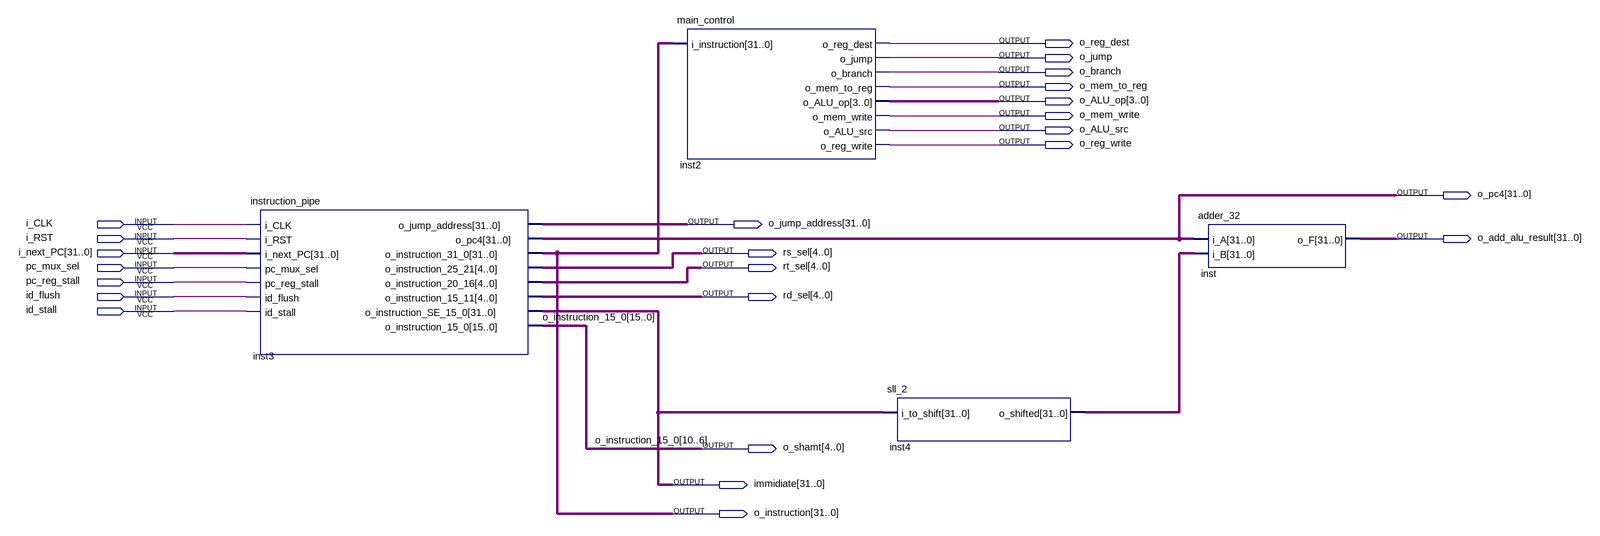
[diagram p0: schematic sheet]
// Quartus schematic instruction_control_pipe.bdf as structural Verilog: 4 symbols, 24 pins
module instruction_control_pipe (
  input  i_CLK,
  input  i_RST,
  input  [31:0] i_next_PC,
  input  pc_mux_sel,
  input  pc_reg_stall,
  input  id_flush,
  input  id_stall,
  output o_reg_dest,
  output o_jump,
  output o_branch,
  output o_mem_to_reg,
  output [3:0] o_ALU_op,
  output o_mem_write,
  output o_ALU_src,
  output o_reg_write,
  output [31:0] o_pc4,
  output [31:0] o_jump_address,
  output [31:0] o_add_alu_result,
  output [4:0] rs_sel,
  output [4:0] rt_sel,
  output [4:0] rd_sel,
  output [4:0] o_shamt,
  output [31:0] immidiate,
  output [31:0] o_instruction
);

  wire [15:0] o_instruction_15_0;
  wire [31:0] inst4_o_shifted;

  instruction_pipe inst3 (
    .i_CLK(i_CLK), .i_RST(i_RST), .i_next_PC(i_next_PC), .pc_mux_sel(pc_mux_sel),
    .pc_reg_stall(pc_reg_stall), .id_flush(id_flush), .id_stall(id_stall), .o_jump_address(o_jump_address),
    .o_pc4(o_pc4), .o_instruction_31_0(o_instruction), .o_instruction_25_21(rs_sel),
    .o_instruction_20_16(rt_sel), .o_instruction_15_11(rd_sel), .o_instruction_SE_15_0(immidiate),
    .o_instruction_15_0({o_instruction_15_0[15:11], o_shamt, o_instruction_15_0[5:0]}));
  main_control inst2 (
    .i_instruction(o_instruction), .o_reg_dest(o_reg_dest), .o_jump(o_jump), .o_branch(o_branch),
    .o_mem_to_reg(o_mem_to_reg), .o_ALU_op(o_ALU_op), .o_mem_write(o_mem_write), .o_ALU_src(o_ALU_src),
    .o_reg_write(o_reg_write));
  sll_2 inst4 (.i_to_shift(immidiate), .o_shifted(inst4_o_shifted));
  adder_32 inst (.i_A(o_pc4), .i_B(inst4_o_shifted), .o_F(o_add_alu_result));

  // Other names for the same wires on the sheet: o_instruction_15_0[10:6] = o_shamt
endmodule
